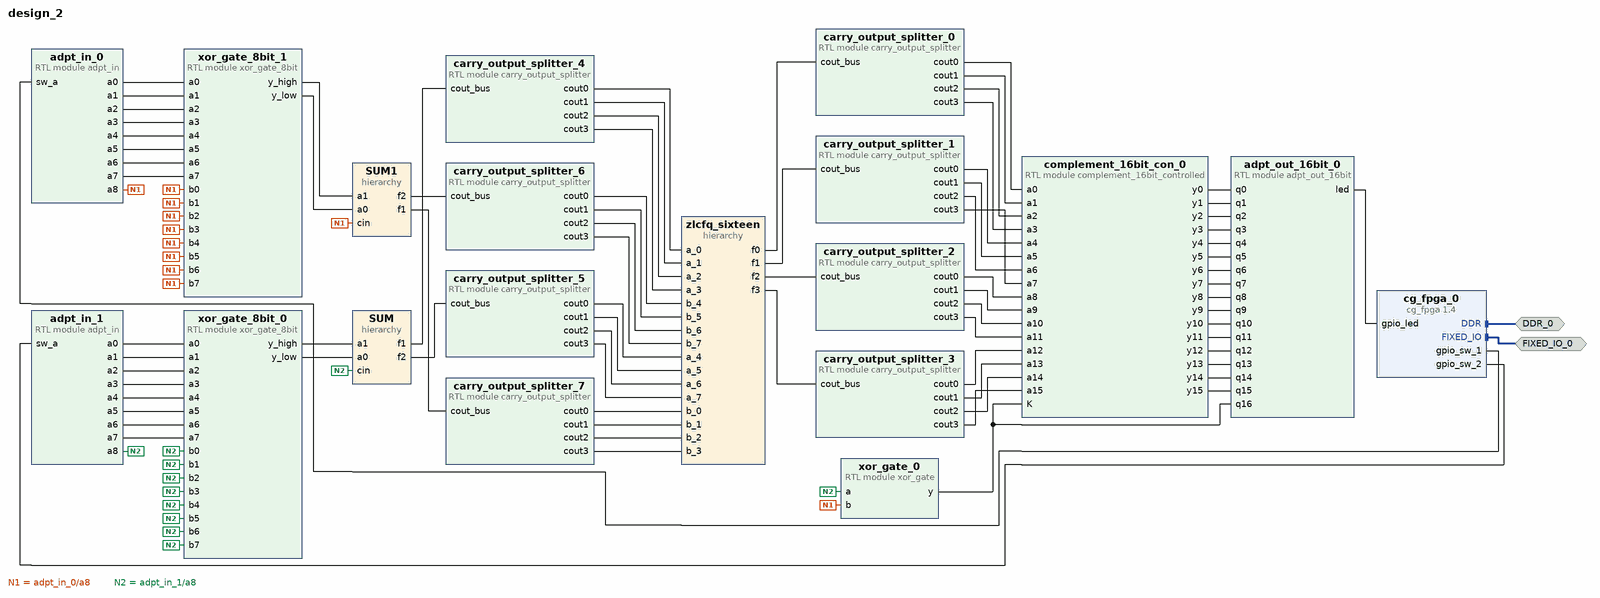
[diagram p0: block diagram of the top level]
# Vivado block design design_2, xc7z020clg400-1, Vivado 2024.2
create_bd_design design_2

create_bd_intf_port -mode Master -vlnv xilinx.com:display_processing_system7:fixedio_rtl:1.0 FIXED_IO_0
create_bd_intf_port -mode Master -vlnv xilinx.com:interface:ddrx_rtl:1.0 DDR_0

create_bd_cell -type ip -vlnv educg.net:user:cg_fpga:1.4 cg_fpga_0
create_bd_cell -type module -reference adpt_in adpt_in_0
create_bd_cell -type module -reference adpt_out_16bit adpt_out_16bit_0
create_bd_cell -type module -reference adpt_in adpt_in_1
create_bd_cell -type module -reference carry_output_splitter carry_output_splitter_0
create_bd_cell -type module -reference carry_output_splitter carry_output_splitter_1
create_bd_cell -type module -reference carry_output_splitter carry_output_splitter_2
create_bd_cell -type module -reference carry_output_splitter carry_output_splitter_3
create_bd_cell -type hier zlcfq_sixteen
create_bd_cell -type hier SUM
create_bd_cell -type module -reference xor_gate_8bit xor_gate_8bit_0
create_bd_cell -type module -reference xor_gate_8bit xor_gate_8bit_1
create_bd_cell -type module -reference carry_output_splitter carry_output_splitter_4
create_bd_cell -type module -reference carry_output_splitter carry_output_splitter_5
create_bd_cell -type hier SUM1
create_bd_cell -type module -reference carry_output_splitter carry_output_splitter_6
create_bd_cell -type module -reference carry_output_splitter carry_output_splitter_7
create_bd_cell -type module -reference complement_16bit_controlled complement_16bit_con_0
create_bd_cell -type module -reference xor_gate xor_gate_0

# ---- hierarchy /zlcfq_sixteen ----
current_bd_instance /zlcfq_sixteen
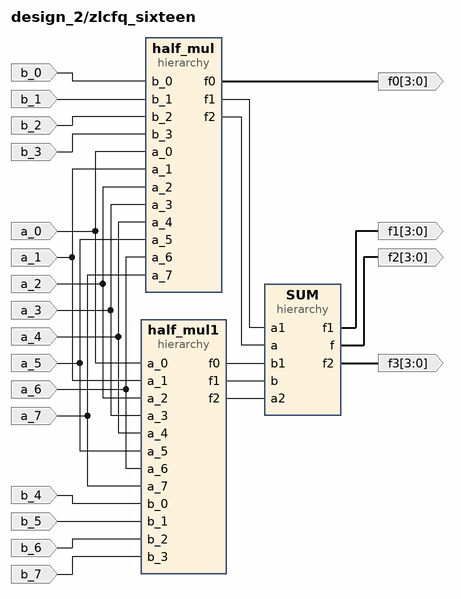
[diagram p1: block diagram inside /zlcfq_sixteen]
create_bd_pin -dir O -from 3 -to 0 f2
create_bd_pin -dir O -from 3 -to 0 f1
create_bd_pin -dir O -from 3 -to 0 f3
create_bd_pin -dir I a_4
create_bd_pin -dir I a_5
create_bd_pin -dir I a_6
create_bd_pin -dir I a_7
create_bd_pin -dir I b_0
create_bd_pin -dir I b_1
create_bd_pin -dir I b_2
create_bd_pin -dir I b_3
create_bd_pin -dir I a_1
create_bd_pin -dir I a_2
create_bd_pin -dir I a_3
create_bd_pin -dir I a_0
create_bd_pin -dir O -from 3 -to 0 f0
create_bd_pin -dir I b_4
create_bd_pin -dir I b_5
create_bd_pin -dir I b_6
create_bd_pin -dir I b_7

create_bd_cell -type hier SUM
create_bd_cell -type hier half_mul
create_bd_cell -type hier half_mul1

# ---- hierarchy /zlcfq_sixteen/SUM ----
current_bd_instance /zlcfq_sixteen/SUM
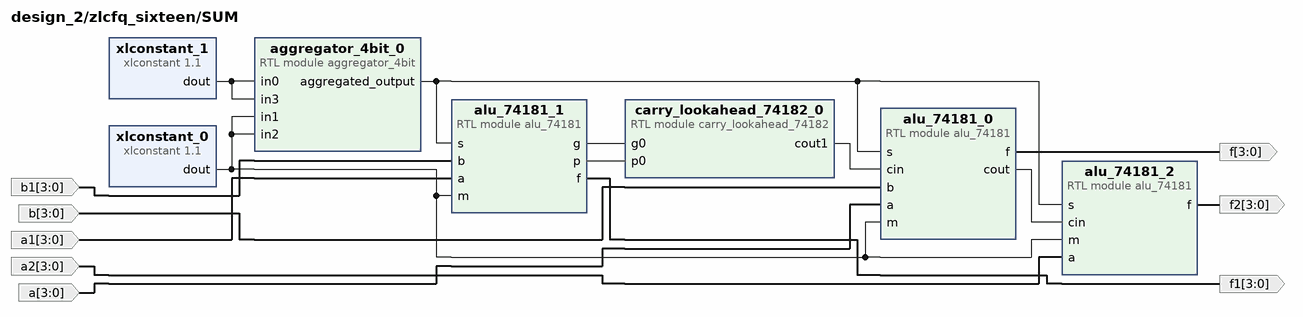
[diagram p2: block diagram inside /zlcfq_sixteen/SUM]
create_bd_pin -dir I -from 3 -to 0 a
create_bd_pin -dir I -from 3 -to 0 b
create_bd_pin -dir O -from 3 -to 0 f
create_bd_pin -dir I -from 3 -to 0 a1
create_bd_pin -dir I -from 3 -to 0 b1
create_bd_pin -dir O -from 3 -to 0 f1
create_bd_pin -dir I -from 3 -to 0 a2
create_bd_pin -dir O -from 3 -to 0 f2

create_bd_cell -type ip -vlnv xilinx.com:ip:xlconstant:1.1 xlconstant_0
set_property -dict {CONFIG.CONST_VAL 0} [get_bd_cells xlconstant_0]
create_bd_cell -type module -reference aggregator_4bit aggregator_4bit_0
create_bd_cell -type ip -vlnv xilinx.com:ip:xlconstant:1.1 xlconstant_1
set_property -dict {CONFIG.CONST_VAL 1} [get_bd_cells xlconstant_1]
create_bd_cell -type module -reference alu_74181 alu_74181_0
create_bd_cell -type module -reference alu_74181 alu_74181_1
create_bd_cell -type module -reference alu_74181 alu_74181_2
create_bd_cell -type module -reference carry_lookahead_74182 carry_lookahead_74182_0

# ---- hierarchy /zlcfq_sixteen/half_mul ----
current_bd_instance /zlcfq_sixteen/half_mul
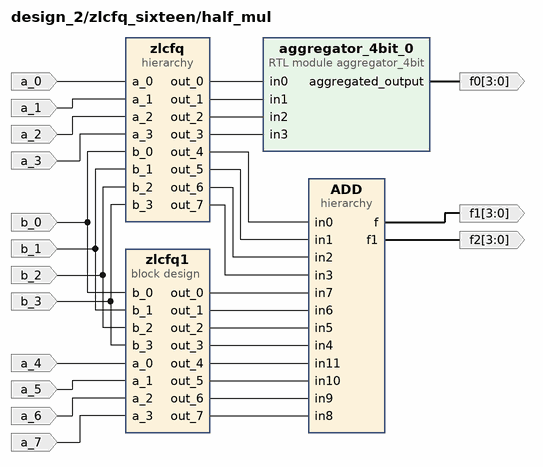
[diagram p3: block diagram inside /zlcfq_sixteen/half_mul]
create_bd_pin -dir I a_4
create_bd_pin -dir I a_5
create_bd_pin -dir I a_6
create_bd_pin -dir I a_7
create_bd_pin -dir I b_0
create_bd_pin -dir I b_1
create_bd_pin -dir I b_2
create_bd_pin -dir I b_3
create_bd_pin -dir I a_1
create_bd_pin -dir I a_2
create_bd_pin -dir I a_3
create_bd_pin -dir I a_0
create_bd_pin -dir O -from 3 -to 0 f1
create_bd_pin -dir O -from 3 -to 0 f2
create_bd_pin -dir O -from 3 -to 0 f0

create_bd_cell -type container -reference zlcfq zlcfq1
set_property -dict [list \
  CONFIG.ACTIVE_SIM_BD zlcfq.bd \
  CONFIG.ACTIVE_SYNTH_BD zlcfq.bd \
  CONFIG.ENABLE_DFX 0 \
  CONFIG.LIST_SIM_BD zlcfq.bd \
  CONFIG.LIST_SYNTH_BD zlcfq.bd \
  CONFIG.LOCK_PROPAGATE 0 \
] [get_bd_cells zlcfq1]
create_bd_cell -type hier zlcfq
create_bd_cell -type hier ADD
create_bd_cell -type module -reference aggregator_4bit aggregator_4bit_0

# ---- hierarchy /zlcfq_sixteen/half_mul/zlcfq ----
current_bd_instance /zlcfq_sixteen/half_mul/zlcfq
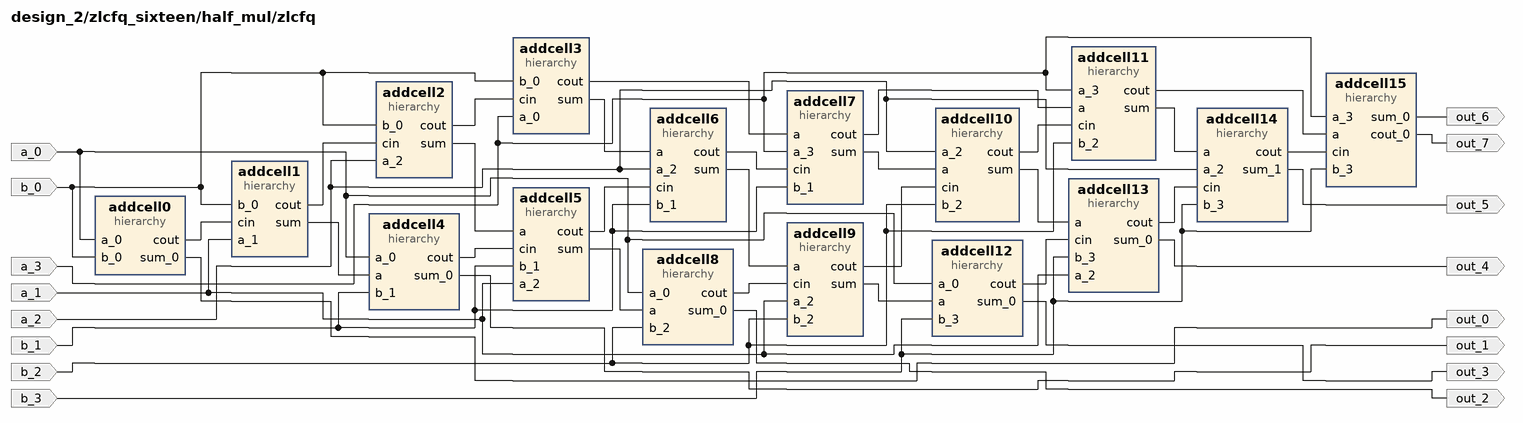
[diagram p4: block diagram inside /zlcfq_sixteen/half_mul/zlcfq]
create_bd_pin -dir O out_4
create_bd_pin -dir I a_1
create_bd_pin -dir I b_3
create_bd_pin -dir I b_0
create_bd_pin -dir I a_2
create_bd_pin -dir O out_5
create_bd_pin -dir I a_3
create_bd_pin -dir O out_1
create_bd_pin -dir I a_0
create_bd_pin -dir I b_1
create_bd_pin -dir O out_2
create_bd_pin -dir I b_2
create_bd_pin -dir O out_3
create_bd_pin -dir O out_0
create_bd_pin -dir O out_6
create_bd_pin -dir O out_7

create_bd_cell -type hier addcell13
create_bd_cell -type hier addcell1
create_bd_cell -type hier addcell2
create_bd_cell -type hier addcell14
create_bd_cell -type hier addcell3
create_bd_cell -type hier addcell4
create_bd_cell -type hier addcell5
create_bd_cell -type hier addcell6
create_bd_cell -type hier addcell7
create_bd_cell -type hier addcell8
create_bd_cell -type hier addcell9
create_bd_cell -type hier addcell10
create_bd_cell -type hier addcell11
create_bd_cell -type hier addcell12
create_bd_cell -type hier addcell0
create_bd_cell -type hier addcell15

# ---- hierarchy /zlcfq_sixteen/half_mul/zlcfq/addcell13 ----
current_bd_instance /zlcfq_sixteen/half_mul/zlcfq/addcell13
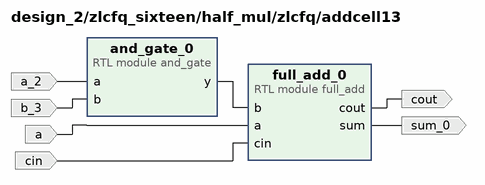
[diagram p5: block diagram inside /zlcfq_sixteen/half_mul/zlcfq/addcell13]
create_bd_pin -dir I cin
create_bd_pin -dir O cout
create_bd_pin -dir I a
create_bd_pin -dir O sum_0
create_bd_pin -dir I a_2
create_bd_pin -dir I b_3

create_bd_cell -type module -reference full_add full_add_0
create_bd_cell -type module -reference and_gate and_gate_0

# ---- hierarchy /zlcfq_sixteen/half_mul/zlcfq/addcell1 ----
current_bd_instance /zlcfq_sixteen/half_mul/zlcfq/addcell1
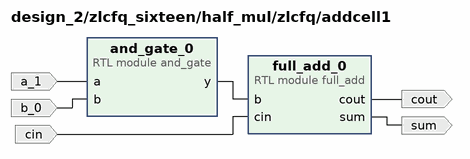
[diagram p6: block diagram inside /zlcfq_sixteen/half_mul/zlcfq/addcell1]
create_bd_pin -dir I cin
create_bd_pin -dir O cout
create_bd_pin -dir O sum
create_bd_pin -dir I a_1
create_bd_pin -dir I b_0

create_bd_cell -type module -reference full_add full_add_0
create_bd_cell -type module -reference and_gate and_gate_0

# ---- hierarchy /zlcfq_sixteen/half_mul/zlcfq/addcell2 ----
current_bd_instance /zlcfq_sixteen/half_mul/zlcfq/addcell2
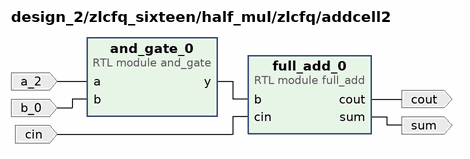
[diagram p7: block diagram inside /zlcfq_sixteen/half_mul/zlcfq/addcell2]
create_bd_pin -dir I cin
create_bd_pin -dir O cout
create_bd_pin -dir O sum
create_bd_pin -dir I a_2
create_bd_pin -dir I b_0

create_bd_cell -type module -reference full_add full_add_0
create_bd_cell -type module -reference and_gate and_gate_0

# ---- hierarchy /zlcfq_sixteen/half_mul/zlcfq/addcell14 ----
current_bd_instance /zlcfq_sixteen/half_mul/zlcfq/addcell14
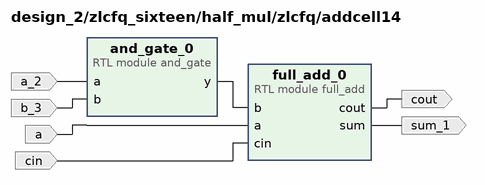
[diagram p8: block diagram inside /zlcfq_sixteen/half_mul/zlcfq/addcell14]
create_bd_pin -dir I cin
create_bd_pin -dir O cout
create_bd_pin -dir I a
create_bd_pin -dir O sum_1
create_bd_pin -dir I a_2
create_bd_pin -dir I b_3

create_bd_cell -type module -reference full_add full_add_0
create_bd_cell -type module -reference and_gate and_gate_0

# ---- hierarchy /zlcfq_sixteen/half_mul/zlcfq/addcell3 ----
current_bd_instance /zlcfq_sixteen/half_mul/zlcfq/addcell3
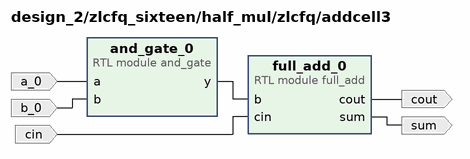
[diagram p9: block diagram inside /zlcfq_sixteen/half_mul/zlcfq/addcell3]
create_bd_pin -dir I cin
create_bd_pin -dir O sum
create_bd_pin -dir O cout
create_bd_pin -dir I a_0
create_bd_pin -dir I b_0

create_bd_cell -type module -reference full_add full_add_0
create_bd_cell -type module -reference and_gate and_gate_0

# ---- hierarchy /zlcfq_sixteen/half_mul/zlcfq/addcell4 ----
current_bd_instance /zlcfq_sixteen/half_mul/zlcfq/addcell4
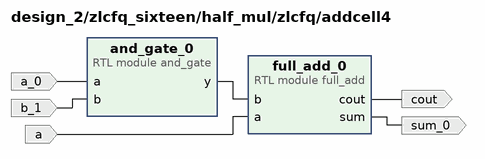
[diagram p10: block diagram inside /zlcfq_sixteen/half_mul/zlcfq/addcell4]
create_bd_pin -dir I a
create_bd_pin -dir O cout
create_bd_pin -dir O sum_0
create_bd_pin -dir I a_0
create_bd_pin -dir I b_1

create_bd_cell -type module -reference full_add full_add_0
create_bd_cell -type module -reference and_gate and_gate_0

# ---- hierarchy /zlcfq_sixteen/half_mul/zlcfq/addcell5 ----
current_bd_instance /zlcfq_sixteen/half_mul/zlcfq/addcell5
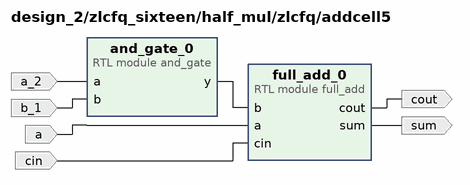
[diagram p11: block diagram inside /zlcfq_sixteen/half_mul/zlcfq/addcell5]
create_bd_pin -dir I cin
create_bd_pin -dir O cout
create_bd_pin -dir I a
create_bd_pin -dir O sum
create_bd_pin -dir I a_2
create_bd_pin -dir I b_1

create_bd_cell -type module -reference full_add full_add_0
create_bd_cell -type module -reference and_gate and_gate_0

# ---- hierarchy /zlcfq_sixteen/half_mul/zlcfq/addcell6 ----
current_bd_instance /zlcfq_sixteen/half_mul/zlcfq/addcell6
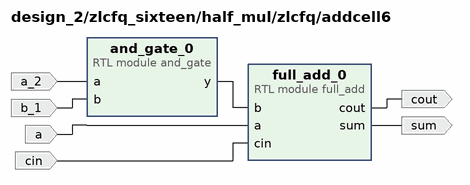
[diagram p12: block diagram inside /zlcfq_sixteen/half_mul/zlcfq/addcell6]
create_bd_pin -dir I cin
create_bd_pin -dir O cout
create_bd_pin -dir I a
create_bd_pin -dir O sum
create_bd_pin -dir I a_2
create_bd_pin -dir I b_1

create_bd_cell -type module -reference full_add full_add_0
create_bd_cell -type module -reference and_gate and_gate_0

# ---- hierarchy /zlcfq_sixteen/half_mul/zlcfq/addcell7 ----
current_bd_instance /zlcfq_sixteen/half_mul/zlcfq/addcell7
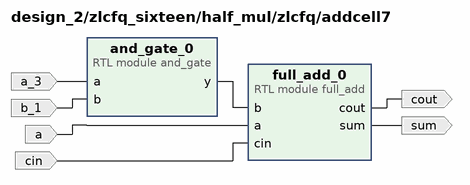
[diagram p13: block diagram inside /zlcfq_sixteen/half_mul/zlcfq/addcell7]
create_bd_pin -dir I cin
create_bd_pin -dir O sum
create_bd_pin -dir I a
create_bd_pin -dir O cout
create_bd_pin -dir I a_3
create_bd_pin -dir I b_1

create_bd_cell -type module -reference full_add full_add_0
create_bd_cell -type module -reference and_gate and_gate_0

# ---- hierarchy /zlcfq_sixteen/half_mul/zlcfq/addcell8 ----
current_bd_instance /zlcfq_sixteen/half_mul/zlcfq/addcell8
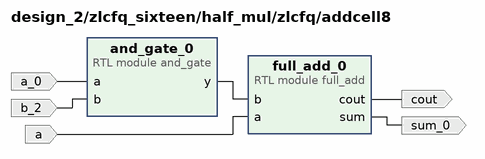
[diagram p14: block diagram inside /zlcfq_sixteen/half_mul/zlcfq/addcell8]
create_bd_pin -dir O cout
create_bd_pin -dir I a
create_bd_pin -dir O sum_0
create_bd_pin -dir I a_0
create_bd_pin -dir I b_2

create_bd_cell -type module -reference full_add full_add_0
create_bd_cell -type module -reference and_gate and_gate_0

# ---- hierarchy /zlcfq_sixteen/half_mul/zlcfq/addcell9 ----
current_bd_instance /zlcfq_sixteen/half_mul/zlcfq/addcell9
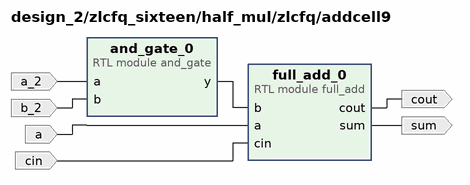
[diagram p15: block diagram inside /zlcfq_sixteen/half_mul/zlcfq/addcell9]
create_bd_pin -dir O cout
create_bd_pin -dir I cin
create_bd_pin -dir I a
create_bd_pin -dir O sum
create_bd_pin -dir I a_2
create_bd_pin -dir I b_2

create_bd_cell -type module -reference full_add full_add_0
create_bd_cell -type module -reference and_gate and_gate_0

# ---- hierarchy /zlcfq_sixteen/half_mul/zlcfq/addcell10 ----
current_bd_instance /zlcfq_sixteen/half_mul/zlcfq/addcell10
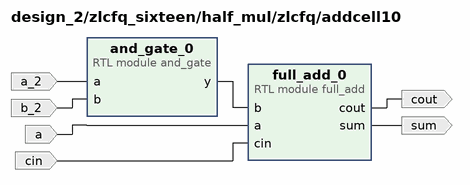
[diagram p16: block diagram inside /zlcfq_sixteen/half_mul/zlcfq/addcell10]
create_bd_pin -dir O cout
create_bd_pin -dir I cin
create_bd_pin -dir I a
create_bd_pin -dir O sum
create_bd_pin -dir I a_2
create_bd_pin -dir I b_2

create_bd_cell -type module -reference full_add full_add_0
create_bd_cell -type module -reference and_gate and_gate_0

# ---- hierarchy /zlcfq_sixteen/half_mul/zlcfq/addcell11 ----
current_bd_instance /zlcfq_sixteen/half_mul/zlcfq/addcell11
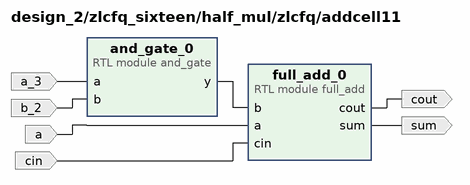
[diagram p17: block diagram inside /zlcfq_sixteen/half_mul/zlcfq/addcell11]
create_bd_pin -dir I cin
create_bd_pin -dir I a
create_bd_pin -dir O sum
create_bd_pin -dir O cout
create_bd_pin -dir I a_3
create_bd_pin -dir I b_2

create_bd_cell -type module -reference full_add full_add_0
create_bd_cell -type module -reference and_gate and_gate_0

# ---- hierarchy /zlcfq_sixteen/half_mul/zlcfq/addcell12 ----
current_bd_instance /zlcfq_sixteen/half_mul/zlcfq/addcell12
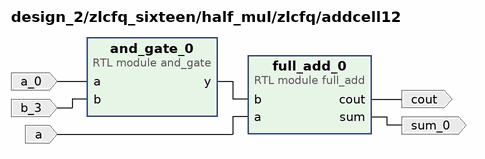
[diagram p18: block diagram inside /zlcfq_sixteen/half_mul/zlcfq/addcell12]
create_bd_pin -dir I a
create_bd_pin -dir O cout
create_bd_pin -dir O sum_0
create_bd_pin -dir I a_0
create_bd_pin -dir I b_3

create_bd_cell -type module -reference full_add full_add_0
create_bd_cell -type module -reference and_gate and_gate_0

# ---- hierarchy /zlcfq_sixteen/half_mul/zlcfq/addcell0 ----
current_bd_instance /zlcfq_sixteen/half_mul/zlcfq/addcell0
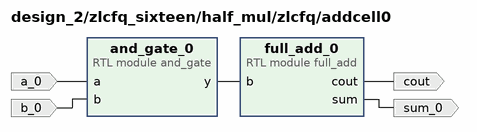
[diagram p19: block diagram inside /zlcfq_sixteen/half_mul/zlcfq/addcell0]
create_bd_pin -dir O cout
create_bd_pin -dir O sum_0
create_bd_pin -dir I a_0
create_bd_pin -dir I b_0

create_bd_cell -type module -reference full_add full_add_0
create_bd_cell -type module -reference and_gate and_gate_0

# ---- hierarchy /zlcfq_sixteen/half_mul/zlcfq/addcell15 ----
current_bd_instance /zlcfq_sixteen/half_mul/zlcfq/addcell15
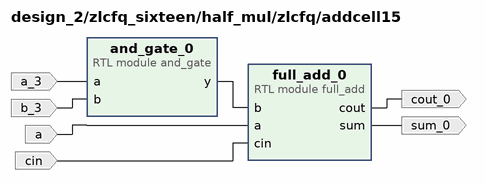
[diagram p20: block diagram inside /zlcfq_sixteen/half_mul/zlcfq/addcell15]
create_bd_pin -dir I cin
create_bd_pin -dir I a
create_bd_pin -dir O sum_0
create_bd_pin -dir O cout_0
create_bd_pin -dir I a_3
create_bd_pin -dir I b_3

create_bd_cell -type module -reference full_add full_add_0
create_bd_cell -type module -reference and_gate and_gate_0

# ---- hierarchy /zlcfq_sixteen/half_mul/ADD ----
current_bd_instance /zlcfq_sixteen/half_mul/ADD
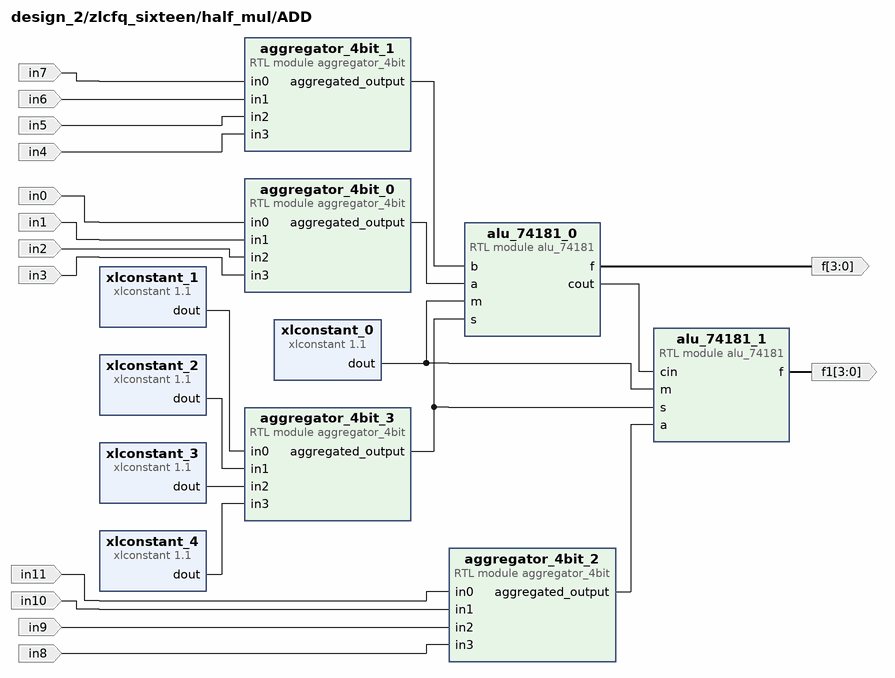
[diagram p21: block diagram inside /zlcfq_sixteen/half_mul/ADD]
create_bd_pin -dir I in3
create_bd_pin -dir I in2
create_bd_pin -dir I in1
create_bd_pin -dir I in0
create_bd_pin -dir I in4
create_bd_pin -dir I in5
create_bd_pin -dir I in6
create_bd_pin -dir I in7
create_bd_pin -dir I in8
create_bd_pin -dir I in9
create_bd_pin -dir I in10
create_bd_pin -dir I in11
create_bd_pin -dir O -from 3 -to 0 f
create_bd_pin -dir O -from 3 -to 0 f1

create_bd_cell -type ip -vlnv xilinx.com:ip:xlconstant:1.1 xlconstant_0
set_property -dict {CONFIG.CONST_VAL 0 CONFIG.CONST_WIDTH 1} [get_bd_cells xlconstant_0]
create_bd_cell -type ip -vlnv xilinx.com:ip:xlconstant:1.1 xlconstant_1
set_property -dict {CONFIG.CONST_WIDTH 1} [get_bd_cells xlconstant_1]
create_bd_cell -type module -reference aggregator_4bit aggregator_4bit_0
create_bd_cell -type module -reference aggregator_4bit aggregator_4bit_1
create_bd_cell -type ip -vlnv xilinx.com:ip:xlconstant:1.1 xlconstant_2
set_property -dict {CONFIG.CONST_VAL 0 CONFIG.CONST_WIDTH 1} [get_bd_cells xlconstant_2]
create_bd_cell -type ip -vlnv xilinx.com:ip:xlconstant:1.1 xlconstant_3
set_property -dict {CONFIG.CONST_VAL 0 CONFIG.CONST_WIDTH 1} [get_bd_cells xlconstant_3]
create_bd_cell -type module -reference aggregator_4bit aggregator_4bit_2
create_bd_cell -type module -reference aggregator_4bit aggregator_4bit_3
create_bd_cell -type ip -vlnv xilinx.com:ip:xlconstant:1.1 xlconstant_4
set_property -dict {CONFIG.CONST_WIDTH 1} [get_bd_cells xlconstant_4]
create_bd_cell -type module -reference alu_74181 alu_74181_0
create_bd_cell -type module -reference alu_74181 alu_74181_1

# ---- hierarchy /zlcfq_sixteen/half_mul1 ----
current_bd_instance /zlcfq_sixteen/half_mul1
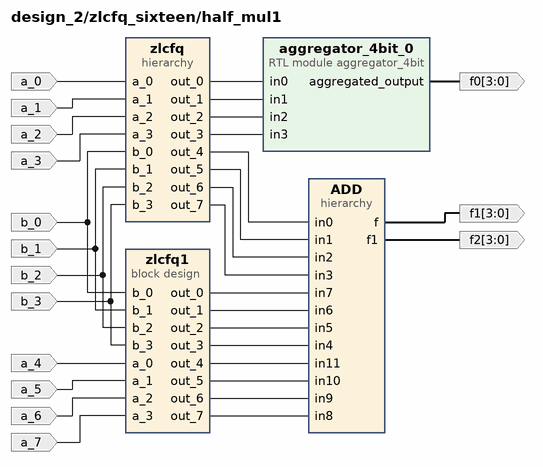
[diagram p22: block diagram inside /zlcfq_sixteen/half_mul1]
create_bd_pin -dir I a_4
create_bd_pin -dir I a_5
create_bd_pin -dir I a_6
create_bd_pin -dir I a_7
create_bd_pin -dir I b_0
create_bd_pin -dir I b_1
create_bd_pin -dir I b_2
create_bd_pin -dir I b_3
create_bd_pin -dir I a_1
create_bd_pin -dir I a_2
create_bd_pin -dir I a_3
create_bd_pin -dir I a_0
create_bd_pin -dir O -from 3 -to 0 f1
create_bd_pin -dir O -from 3 -to 0 f2
create_bd_pin -dir O -from 3 -to 0 f0

create_bd_cell -type container -reference zlcfq zlcfq1
set_property -dict [list \
  CONFIG.ACTIVE_SIM_BD zlcfq.bd \
  CONFIG.ACTIVE_SYNTH_BD zlcfq.bd \
  CONFIG.ENABLE_DFX 0 \
  CONFIG.LIST_SIM_BD zlcfq.bd \
  CONFIG.LIST_SYNTH_BD zlcfq.bd \
  CONFIG.LOCK_PROPAGATE 0 \
] [get_bd_cells zlcfq1]
create_bd_cell -type hier zlcfq
create_bd_cell -type hier ADD
create_bd_cell -type module -reference aggregator_4bit aggregator_4bit_0

# ---- hierarchy /zlcfq_sixteen/half_mul1/zlcfq ----
current_bd_instance /zlcfq_sixteen/half_mul1/zlcfq
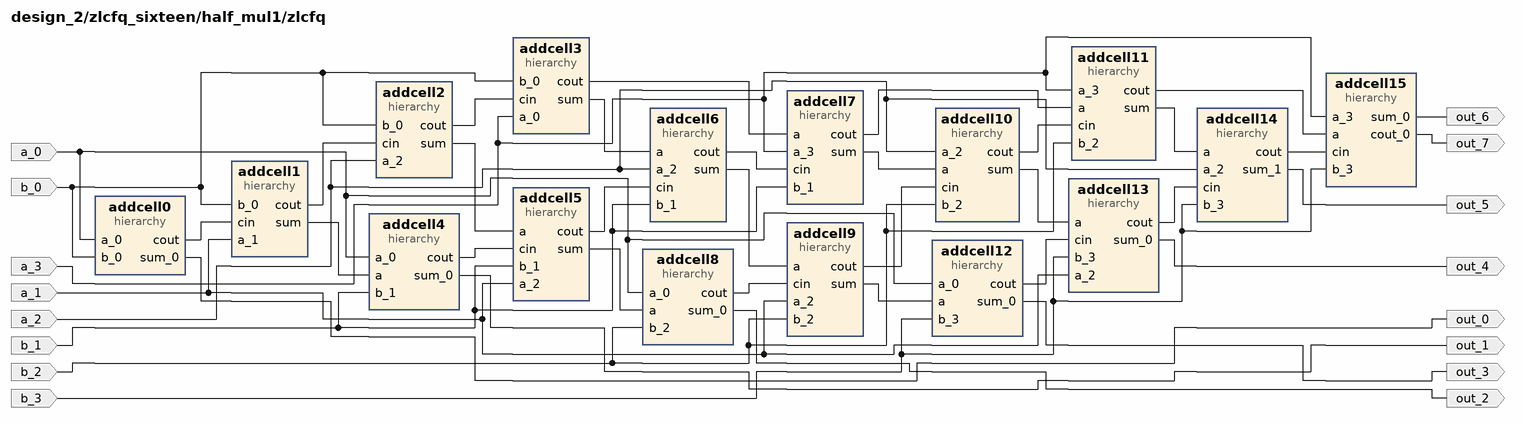
[diagram p23: block diagram inside /zlcfq_sixteen/half_mul1/zlcfq]
create_bd_pin -dir O out_4
create_bd_pin -dir I a_1
create_bd_pin -dir I b_3
create_bd_pin -dir I b_0
create_bd_pin -dir I a_2
create_bd_pin -dir O out_5
create_bd_pin -dir I a_3
create_bd_pin -dir O out_1
create_bd_pin -dir I a_0
create_bd_pin -dir I b_1
create_bd_pin -dir O out_2
create_bd_pin -dir I b_2
create_bd_pin -dir O out_3
create_bd_pin -dir O out_0
create_bd_pin -dir O out_6
create_bd_pin -dir O out_7

create_bd_cell -type hier addcell13
create_bd_cell -type hier addcell1
create_bd_cell -type hier addcell2
create_bd_cell -type hier addcell14
create_bd_cell -type hier addcell3
create_bd_cell -type hier addcell4
create_bd_cell -type hier addcell5
create_bd_cell -type hier addcell6
create_bd_cell -type hier addcell7
create_bd_cell -type hier addcell8
create_bd_cell -type hier addcell9
create_bd_cell -type hier addcell10
create_bd_cell -type hier addcell11
create_bd_cell -type hier addcell12
create_bd_cell -type hier addcell0
create_bd_cell -type hier addcell15

# ---- hierarchy /zlcfq_sixteen/half_mul1/zlcfq/addcell13 ----
current_bd_instance /zlcfq_sixteen/half_mul1/zlcfq/addcell13
